# Altium schematic sheet gasPrs_SingleChannel.SchDoc
size A4
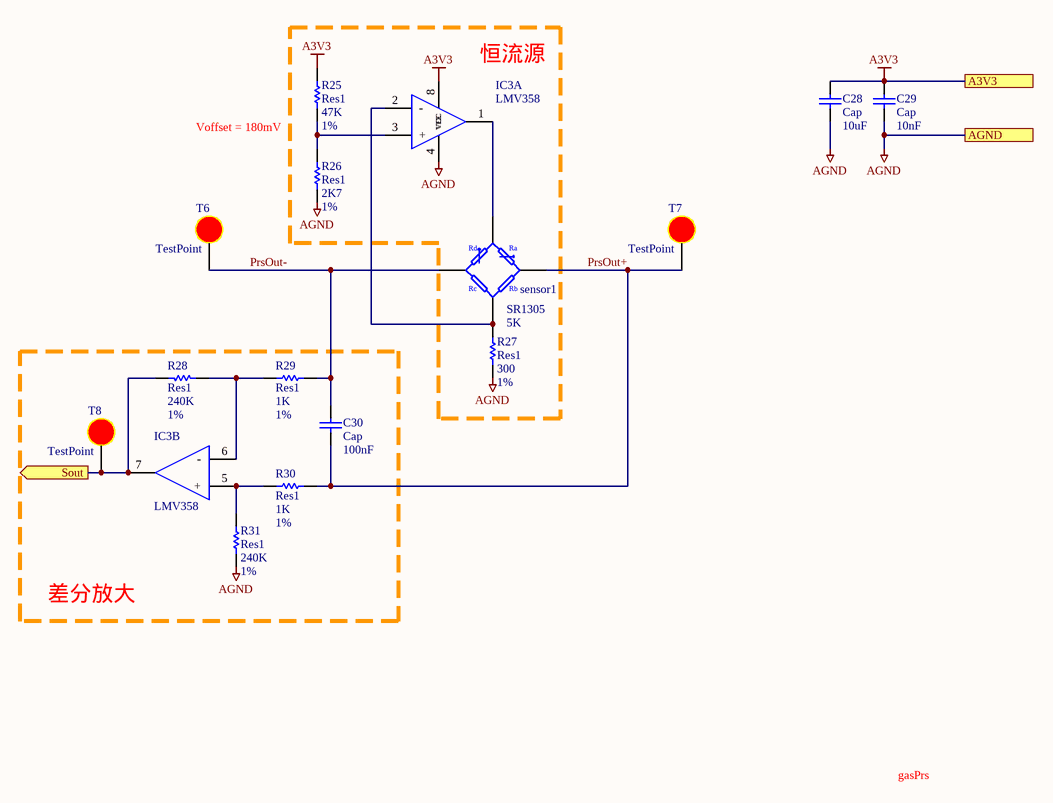
[diagram p0: gasPrs_SingleChannel.SchDoc]

## Parts
C28  Cap  value 10uF  [0603C]
C29  Cap  value 10nF  [0603C]
C30  Cap  value 100nF  [0603C]
IC3  LMV358  [SOIC127P600X175-8N]  (parts A,B of 2)
R25  Res1  value 47K  Delta: 1%  [0603R]
R26  Res1  value 2K7  Delta: 1%  [0603R]
R27  Res1  value 300  Delta: 1%  [0603R]
R28  Res1  value 240K  Delta: 1%  [0603R]
R29  Res1  value 1K  Delta: 1%  [0603R]
R30  Res1  value 1K  Delta: 1%  [0603R]
R31  Res1  value 240K  Delta: 1%  [0603R]
sensor1  SR1305  value 5K  [SENSON]
T6  TestPoint  [TP_D1mm]
T7  TestPoint  [TP_D1mm]
T8  TestPoint  [TP_D1mm]

## Blocks framed on the sheet
恒流源: IC3 R25-R27 sensor1
差分放大: C30 IC3 R28-R31 T8

## Ports
A3V3, AGND, Sout (out)

## Nets
A3V3: C28.2 C29.2 IC3.8(VCC) R25.1 ; port A3V3
AGND: C28.1 C29.1 IC3.4(VEE) R26.2 R27.1 R31.1 ; port AGND
PrsOut+: C30.1 R30.1 sensor1.2 T7.9
PrsOut-: C30.2 R29.1 sensor1.4 T6.9
Sout: IC3.7(OUTB) R28.1 T8.9 ; port Sout
NetIC3_1: IC3.1(OUTA) sensor1.1
NetIC3_2: IC3.2(-) R27.2 sensor1.3
NetIC3_3: IC3.3(+) R25.2 R26.1
NetIC3_5: IC3.5(+) R30.2 R31.2
NetIC3_6: IC3.6(-) R28.2 R29.2

## Notes on the sheet
- Voffset = 180mV
- gasPrs
- (in symbol Res Bridge) Rd; Ra; Rc; Rb

## Library data of the parts
C28-C30 = Cap: Capacitor; Published: 8-Jun-2000; LatestRevisionDate: 17-Jul-2002; LatestRevisionNote: Re-released for DXP Platform.; PackageReference: RAD-0.3; Publisher: Altium Limited; PackageDescription: Radial Cap, Thru-Hole; 2 Leads; 0.3 in Pin Spacing
IC3 = LMV358MX_NOPB: Integrated Circuit; Manufacturer_Name: Texas Instruments; Manufacturer_Part_Number: LMV358MX/NOPB; Datasheet Link: http://www.ti.com/lit/gpn/lmv358-n; Height: 1.75mm; Mouser Part Number: 926-LMV358MX/NOPB; Mouser Price/Stock: https://www.mouser.co.uk/ProductDetail/Texas-Instruments/LMV358MX-NOPB?qs=7lkVKPoqpbaZWqXefrgn%2Fg%3D%3D; Arrow Part Number: LMV358MX/NOPB; Arrow Price/Stock: https://www.arrow.com/en/products/lmv358mxnopb/texas-instruments?region=nac
R25-R31 = Res1: Resistor; Published: 8-Jun-2000; LatestRevisionDate: 17-Jul-2002; LatestRevisionNote: Re-released for DXP Platform.; PackageReference: AXIAL-0.3; Publisher: Altium Limited; PackageDescription: Axial Device, Thru-Hole; 2 Leads; 0.3 in Pin Spacing
sensor1 = Res Bridge: Resistor Bridge; Published: 24-Mar-1999; LatestRevisionDate: 17-Jul-2002; LatestRevisionNote: Re-released for DXP Platform.; PackageReference: P04A; Publisher: Altium Limited
T6-T8 = TP: 测试点